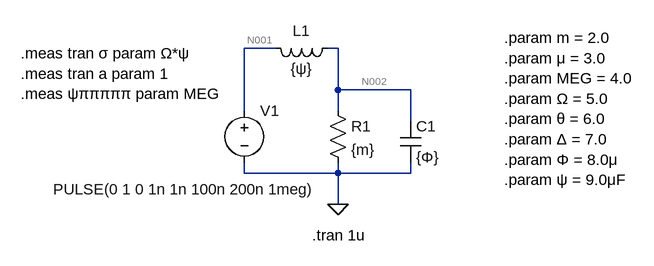
[diagram p0: schematic test15.asc]
test15.asc, the LTspice schematic file:
Version 4
SHEET 1 880 680
WIRE 144 48 96 48
WIRE 240 48 224 48
WIRE 240 112 240 48
WIRE 352 112 240 112
WIRE 96 144 96 48
WIRE 240 144 240 112
WIRE 352 160 352 112
WIRE 96 240 96 224
WIRE 240 240 240 224
WIRE 240 240 96 240
WIRE 352 240 352 224
WIRE 352 240 240 240
WIRE 240 288 240 240
FLAG 240 288 0
SYMBOL voltage 96 128 R0
WINDOW 3 -294 137 Left 2
WINDOW 123 0 0 Left 2
WINDOW 39 0 0 Left 2
SYMATTR Value PULSE(0 1 0 1n 1n 100n 200n 1meg)
SYMATTR InstName V1
SYMBOL res 224 128 R0
SYMATTR InstName R1
SYMATTR Value {m}
SYMBOL cap 336 160 R0
SYMATTR InstName C1
SYMATTR Value {Φ}
SYMBOL ind 240 32 R90
WINDOW 0 5 56 VBottom 2
WINDOW 3 32 56 VTop 2
SYMATTR InstName L1
SYMATTR Value {ψ}
TEXT 200 336 Left 2 !.tran 1u
TEXT 496 32 Left 2 !.param m = 2.0\n.param μ = 3.0\n.param MEG = 4.0\n.param Ω = 5.0\n.param θ = 6.0\n.param Δ = 7.0\n.param Φ = 8.0μ\n.param ψ = 9.0μF
TEXT -248 56 Left 2 !.meas tran σ param Ω*ψ\n.meas tran a param 1\n.meas ψπππππ param MEG

The netlist it stands for:
* test15.asc
V1 N001 0 PULSE(0 1 0 1n 1n 100n 200n 1meg)
R1 N002 0 {m}
C1 N002 0 {Φ}
L1 N002 N001 {ψ}
.tran 1u
.param m = 2.0
.param μ = 3.0
.param MEG = 4.0
.param Ω = 5.0
.param θ = 6.0
.param Δ = 7.0
.param Φ = 8.0μ
.param ψ = 9.0μF
.meas tran σ param Ω*ψ
.meas tran a param 1
.meas ψπππππ param MEG
.backanno
.end

* Results of the author's LTspice run, read from the files saved beside the schematic
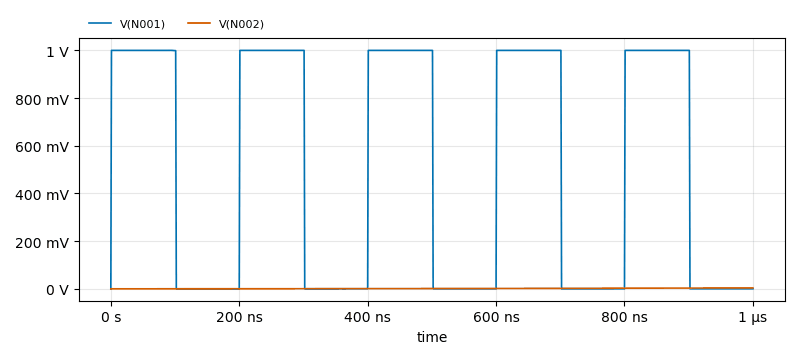
[diagram p1: Transient Analysis of test15.asc, plotted from the saved traces]
* Transient Analysis, 1 run:
*   V(N001): min 0 V, max 1 V, average 505 mV, rms 710.5 mV, last 0 V
*   V(N002): min 0 V, max 3.763 mV, average 1.319 mV, rms 1.735 mV, last 3.763 mV
* From the log:
*   σ: Ω*ψ=4.5e-05
*   a: 1=1
*   ψπππππ: MEG=4